# Altium schematic sheet GENERADORA V1.5.SchDoc
size A3; SheetNumber: 1; SheetTotal: 7
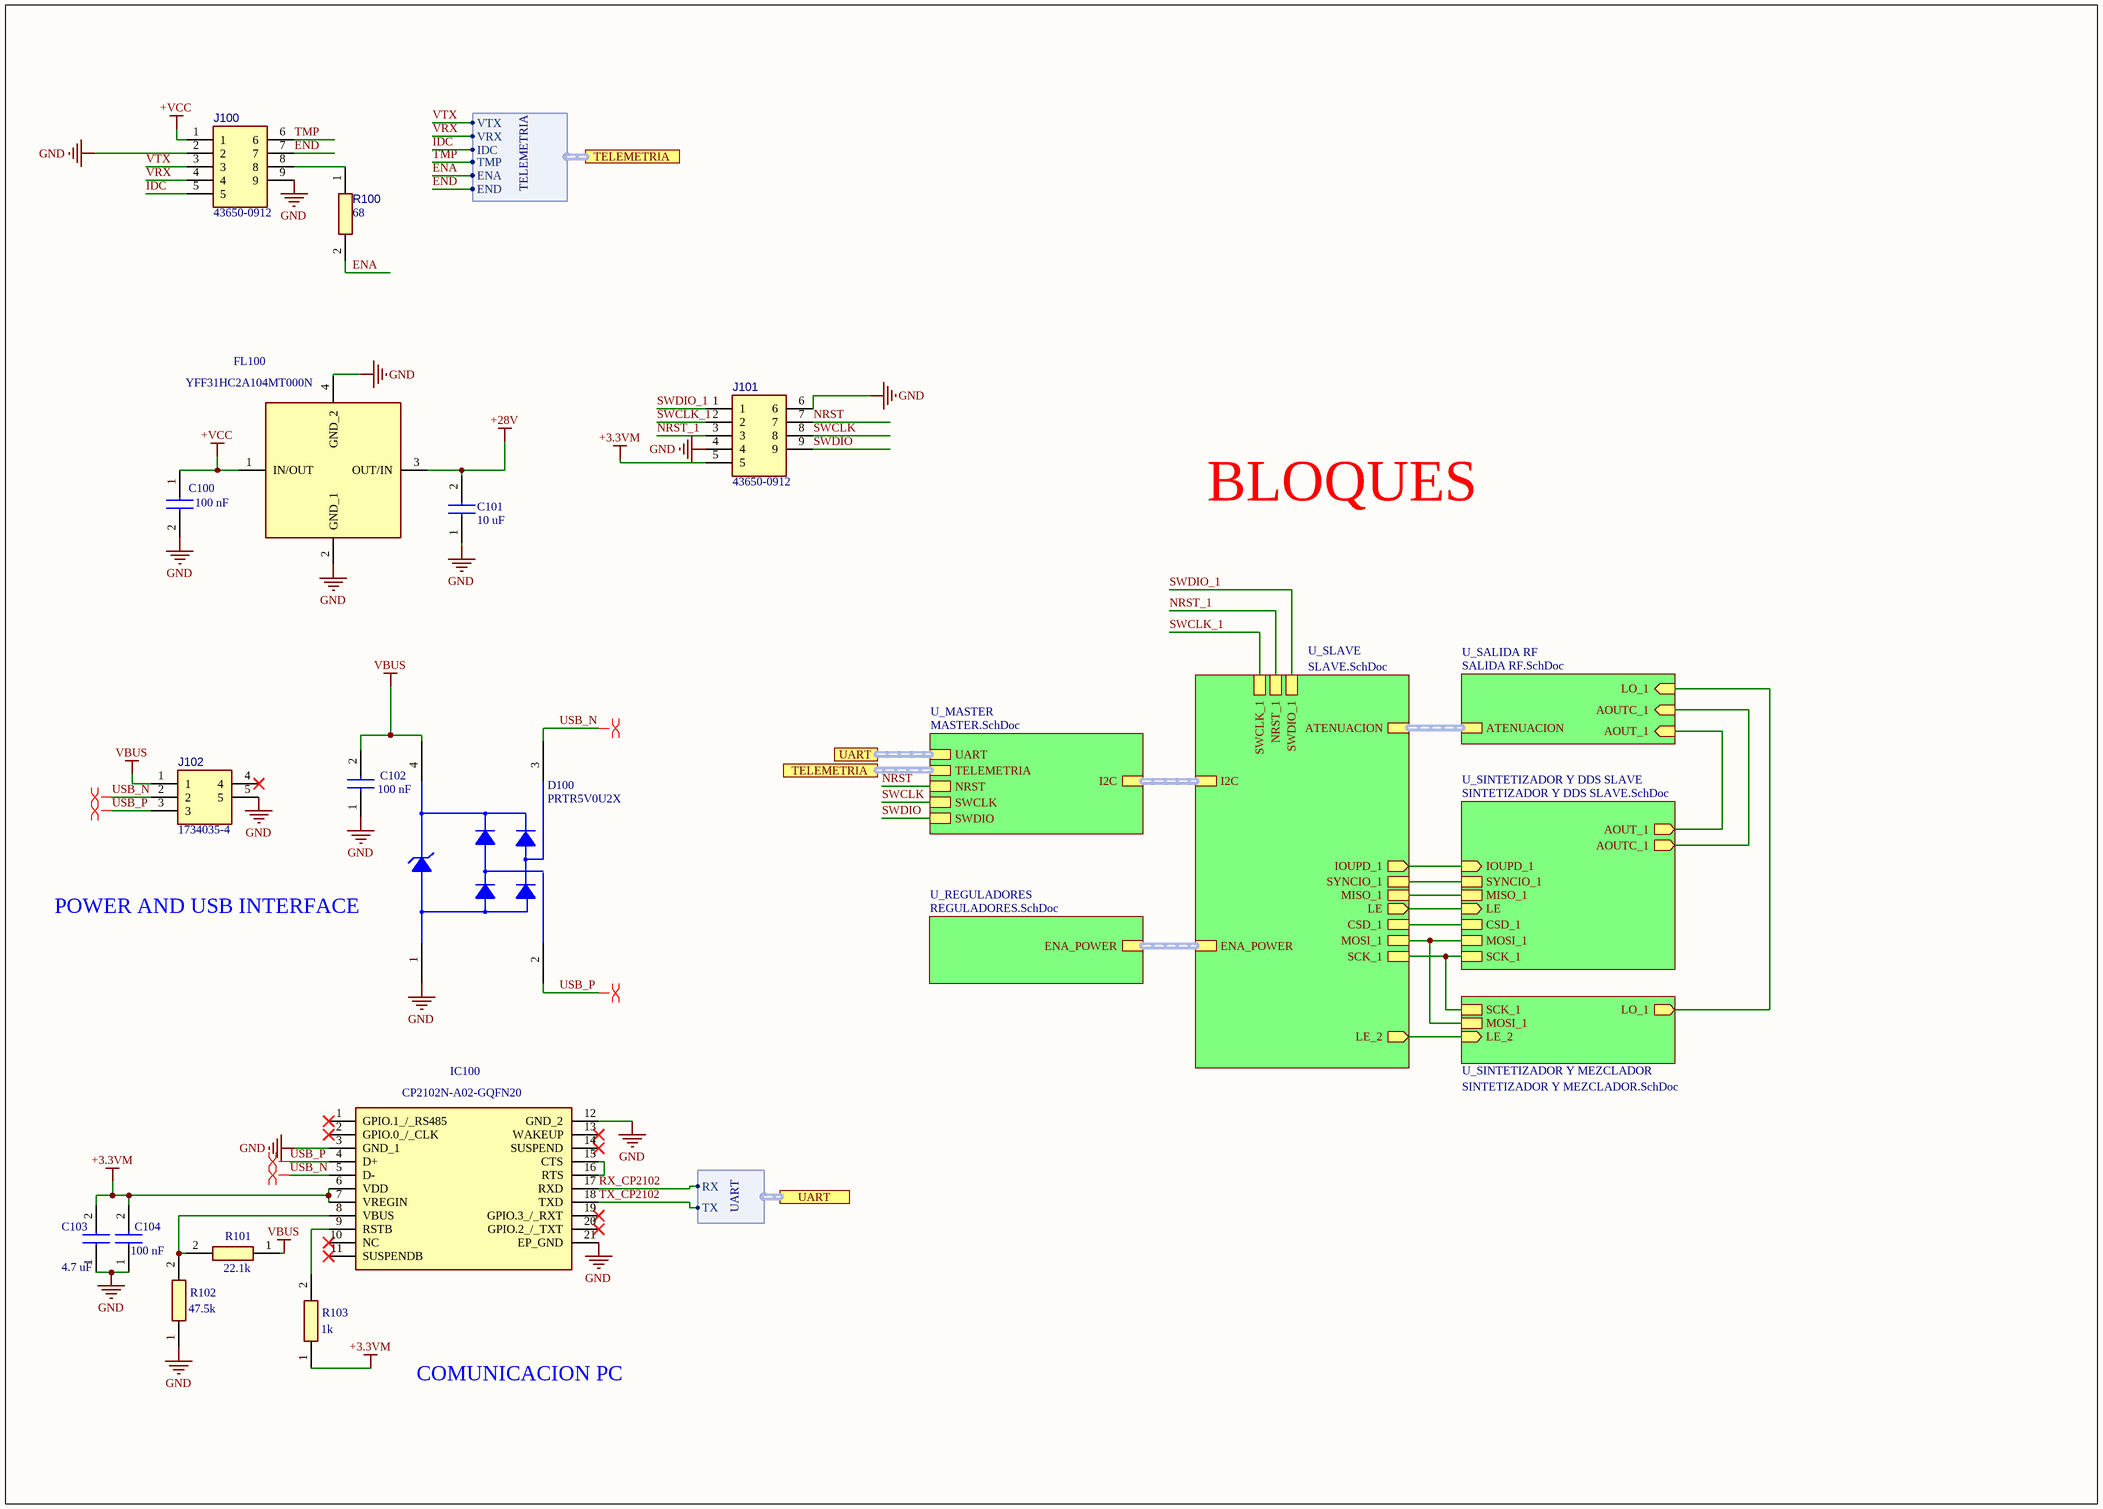
[diagram p0: GENERADORA V1.5.SchDoc]

## Parts
C100  100 nF  [CAPC3216X94N]
C101  10 uF  [CAPC3216X94N]
C102  100 nF  [CAPC3216X94N]
C103  4.7 uF  [C0603]
C104  100 nF  [C0603]
D100  PRTR5V0U2X  [AP4-00001]
FL100  YFF31HC2A104MT000N  [YFF31HC2A104MT000N]
IC100  CP2102N-A02-GQFN20  [CP2102NA02GQFN20]
J100  43650-0912  [43650-09(12,13,14)]
J101  43650-0912  [43650-09(12,13,14)]
J102  1734035-4  [1734035-2USB]
R100  68  [RESC1608X55N]
R101  22.1k  [RESC1608X55N]
R102  47.5k  [RESC1608X55N]
R103  1k  [RESC1608X55N]

## Sub-sheets
U_MASTER = MASTER.SchDoc: I2C (harness I2C), UART (harness UART), TELEMETRIA (harness TELEMETRIA), NRST, SWCLK, SWDIO
U_REGULADORES = REGULADORES.SchDoc: ENA_POWER (harness ENA_POWER)
U_SALIDA RF = SALIDA RF.SchDoc: LO_1 (in), AOUTC_1 (in), AOUT_1 (in), ATENUACION (harness ATENUACION)
U_SINTETIZADOR Y DDS SLAVE = SINTETIZADOR Y DDS SLAVE.SchDoc: AOUTC_1 (out), AOUT_1 (out), CSD_1, SCK_1, MISO_1, SYNCIO_1, MOSI_1, LE (in), IOUPD_1 (in)
U_SINTETIZADOR Y MEZCLADOR = SINTETIZADOR Y MEZCLADOR.SchDoc: SCK_1, MOSI_1, LE_2 (in), LO_1 (out)
U_SLAVE = SLAVE.SchDoc: IOUPD_1 (out), LE (out), LE_2 (out), I2C (harness I2C), ATENUACION (harness ATENUACION), SWCLK_1, SWDIO_1, NRST_1, ENA_POWER (harness ENA_POWER), CSD_1, MISO_1, MOSI_1, SCK_1, SYNCIO_1

## Ports
TELEMETRIA (harness TELEMETRIA), UART (harness TELEMETRIA), UART (harness UART)

## Harnesses
UART: RX, TX
TELEMETRIA: VTX, VRX, IDC, TMP, ENA, END

## Nets
+3.3VM: C103.2 C104.2 IC100.6(VDD) IC100.7(VREGIN) J101.5 R103.1
+28V: C101.2 FL100.3(OUT/IN)
+VCC: C100.1 FL100.1(IN/OUT) J100.1
GND: C100.2 C101.1 C102.1 C103.1 C104.1 D100.1(GND) FL100.2(GND_1) FL100.4(GND_2) IC100.3(GND_1) IC100.12(GND_2) IC100.21(EP_GND) J100.2 J100.9 J101.4 J101.6 J102.5 R102.1
VBUS: C102.2 D100.4(VCC) J102.1 R101.1
ENA: R100.2 ; port TELEMETRIA.ENA
END: J100.7 ; port TELEMETRIA.END
IDC: J100.5 ; port TELEMETRIA.IDC
NRST: J101.7 ; sheet U_MASTER/NRST
NRST_1: J101.3 ; sheet U_SLAVE/NRST_1
RX_CP2102: IC100.17(RXD) ; port UART.RX
SWCLK: J101.8 ; sheet U_MASTER/SWCLK
SWCLK_1: J101.2 ; sheet U_SLAVE/SWCLK_1
SWDIO: J101.9 ; sheet U_MASTER/SWDIO
SWDIO_1: J101.1 ; sheet U_SLAVE/SWDIO_1
TMP: J100.6 ; port TELEMETRIA.TMP
TX_CP2102: IC100.18(TXD) ; port UART.TX
USB_N: D100.3(I/O_2) IC100.5(D-) J102.2
USB_P: D100.2(I/O_1) IC100.4(D+) J102.3
VRX: J100.4 ; port TELEMETRIA.VRX
VTX: J100.3 ; port TELEMETRIA.VTX
NetIC100_8: IC100.8(VBUS) R101.2 R102.2
NetIC100_9: IC100.9(RSTB) R103.2
NetIC100_15: IC100.15(CTS) IC100.16(RTS)
NetJ100_8: J100.8 R100.1
(unnamed): sheet U_SALIDA RF/LO_1, sheet U_SINTETIZADOR Y MEZCLADOR/LO_1
(unnamed): sheet U_SALIDA RF/AOUTC_1, sheet U_SINTETIZADOR Y DDS SLAVE/AOUTC_1
(unnamed): sheet U_SALIDA RF/AOUT_1, sheet U_SINTETIZADOR Y DDS SLAVE/AOUT_1
(unnamed): sheet U_SINTETIZADOR Y DDS SLAVE/CSD_1, sheet U_SLAVE/CSD_1
(unnamed): sheet U_SINTETIZADOR Y DDS SLAVE/SCK_1, sheet U_SINTETIZADOR Y MEZCLADOR/SCK_1, sheet U_SLAVE/SCK_1
(unnamed): sheet U_SINTETIZADOR Y DDS SLAVE/MISO_1, sheet U_SLAVE/MISO_1
(unnamed): sheet U_SINTETIZADOR Y DDS SLAVE/SYNCIO_1, sheet U_SLAVE/SYNCIO_1
(unnamed): sheet U_SINTETIZADOR Y DDS SLAVE/MOSI_1, sheet U_SINTETIZADOR Y MEZCLADOR/MOSI_1, sheet U_SLAVE/MOSI_1
(unnamed): sheet U_SINTETIZADOR Y DDS SLAVE/LE, sheet U_SLAVE/LE
(unnamed): sheet U_SINTETIZADOR Y DDS SLAVE/IOUPD_1, sheet U_SLAVE/IOUPD_1
(unnamed): sheet U_SINTETIZADOR Y MEZCLADOR/LE_2, sheet U_SLAVE/LE_2

Not connected (* = marked no-connect by the designer): IC100 1(GPIO.1_/_RS485)* 2(GPIO.0_/_CLK)* 10(NC)* 11(SUSPENDB)* 13(WAKEUP)* 14(SUSPEND)* 19(GPIO.3_/_RXT)* 20(GPIO.2_/_TXT)*; J102 4*

## Buses and harness runs
harness port TELEMETRIA = sheet U_MASTER/TELEMETRIA
harness port UART = sheet U_MASTER/UART
harness sheet U_MASTER/I2C = sheet U_SLAVE/I2C
harness sheet U_REGULADORES/ENA_POWER = sheet U_SLAVE/ENA_POWER
harness sheet U_SALIDA RF/ATENUACION = sheet U_SLAVE/ATENUACION

## Layout directives
differential pair; differential pair class USB: USB_N, USB_P

## Notes on the sheet
- BLOQUES
- POWER AND USB INTERFACE
- COMUNICACION PC

## Library data of the parts
C100-C102 = KAM31BR81H103KT: Capacitor; Manufacturer_Name: KYOCERA; Datasheet Link: https://datasheets.kyocera-avx.com/AutoMLCCKAM.pdf; Height: 0.94mm; Manufacturer_Part_Number: KAM31BR81H103KT; Mouser Part Number: 581-KAM31BR81H103KT; Mouser Price/Stock: https://www.mouser.co.uk/ProductDetail/KYOCERA-AVX/KAM31BR81H103KT?qs=Jm2GQyTW%2FbjzijSUJGW%2FJA%3D%3D
C103 C104 = C0603H470J5GACTU: Capacitor; Manufacturer_Name: KEMET; Datasheet Link: https://content.kemet.com/datasheets/KEM_C1001_C0G_200C_SMD.pdf; Height: 0.87mm; Manufacturer_Part_Number: C0603H470J5GACTU
D100 = PRTR5V0U2X: Double rail-to-rail USB ESD protection diode; OrcadPartType: Integrated Circuits&Special function&Protection; Manufacturer: Philips; AN: A06-0236; TemperatureRange: -40 to +85 C; Value: PRTR5V0U2X; PartType: Buy; Height: 1,10000002384186; MPN: PRTR5V0U2X
FL100 = YFF31HC2A104MT000N: Filter; Manufacturer_Name: TDK; Datasheet Link: https://product.tdk.com/system/files/dam/doc/product/emc/emc/3tf/catalog/3tf_commercial_power_yff-hc_en.pdf; Height: 1.5mm; Manufacturer_Part_Number: YFF31HC2A104MT000N; Mouser Part Number: 810-YFF31HC2A104MTHN; Mouser Price/Stock: https://www.mouser.co.uk/ProductDetail/TDK/YFF31HC2A104MT000N?qs=1gGcJ6gR7Y2xnDLNcVCkdg%3D%3D; Arrow Part Number: YFF31HC2A104MT000N; Arrow Price/Stock: https://www.arrow.com/en/products/yff31hc2a104mt000n/tdk?region=nac
IC100 = CP2102N-A02-GQFN20: Integrated Circuit; Manufacturer_Name: Silicon Labs; Datasheet Link: https://www.silabs.com/documents/public/data-sheets/cp2102n-datasheet.pdf; Height: 0.8mm; Manufacturer_Part_Number: CP2102N-A02-GQFN20; Mouser Part Number: 634-CP2102NA02GQFN20; Mouser Price/Stock: https://www.mouser.co.uk/ProductDetail/Silicon-Labs/CP2102N-A02-GQFN20?qs=u16ybLDytRaG8WdlP0fT2g%3D%3D; Arrow Part Number: CP2102N-A02-GQFN20; Arrow Price/Stock: https://www.arrow.com/en/products/cp2102n-a02-gqfn20/silicon-labs?region=europe
J100 J101 = 43650-0912: Connector; Manufacturer_Name: Molex; Datasheet Link: https://www.molex.com/pdm_docs/sd/436500212_sd.pdf; Height: 5.57mm; Manufacturer_Part_Number: 43650-0912; Mouser Part Number: 538-43650-0912; Mouser Price/Stock: https://www.mouser.co.uk/ProductDetail/Molex/43650-0912?qs=lm8WgJiVcEuC1RHlaQB4sg%3D%3D
J102 = 1734035-4: Connector; Manufacturer_Name: TE Connectivity; Datasheet Link: http://www.te.com/commerce/DocumentDelivery/DDEController?Action=srchrtrv&DocNm=1734035&DocType=Customer+Drawing&DocLang=English&DocFormat=pdf&PartCntxt=1734035-4; Manufacturer_Part_Number: 1734035-4; Mouser Part Number: 571-1734035-4; Mouser Price/Stock: https://www.mouser.co.uk/ProductDetail/TE-Connectivity/1734035-4?qs=ZYpP4JSRRNCyjylIh5thIQ%3D%3D; Arrow Part Number: 1734035-4; Arrow Price/Stock: https://www.arrow.com/en/products/1734035-4/te-connectivity?region=nac
R100-R103 = CR0603-FX-1431ELF: Resistor; Manufacturer_Name: Bourns; Datasheet Link: https://www.bourns.com/pdfs/chpreztr.pdf; Height: 0.55mm; Manufacturer_Part_Number: CR0603-FX-1431ELF; Mouser Part Number: 652-CR0603FX-1431ELF; Mouser Price/Stock: https://www.mouser.co.uk/ProductDetail/Bourns/CR0603-FX-1431ELF?qs=e7cxVwPieurCzASkAzK2%252Bg%3D%3D